# EAGLE design SCH (EAGLE 9.4.2)
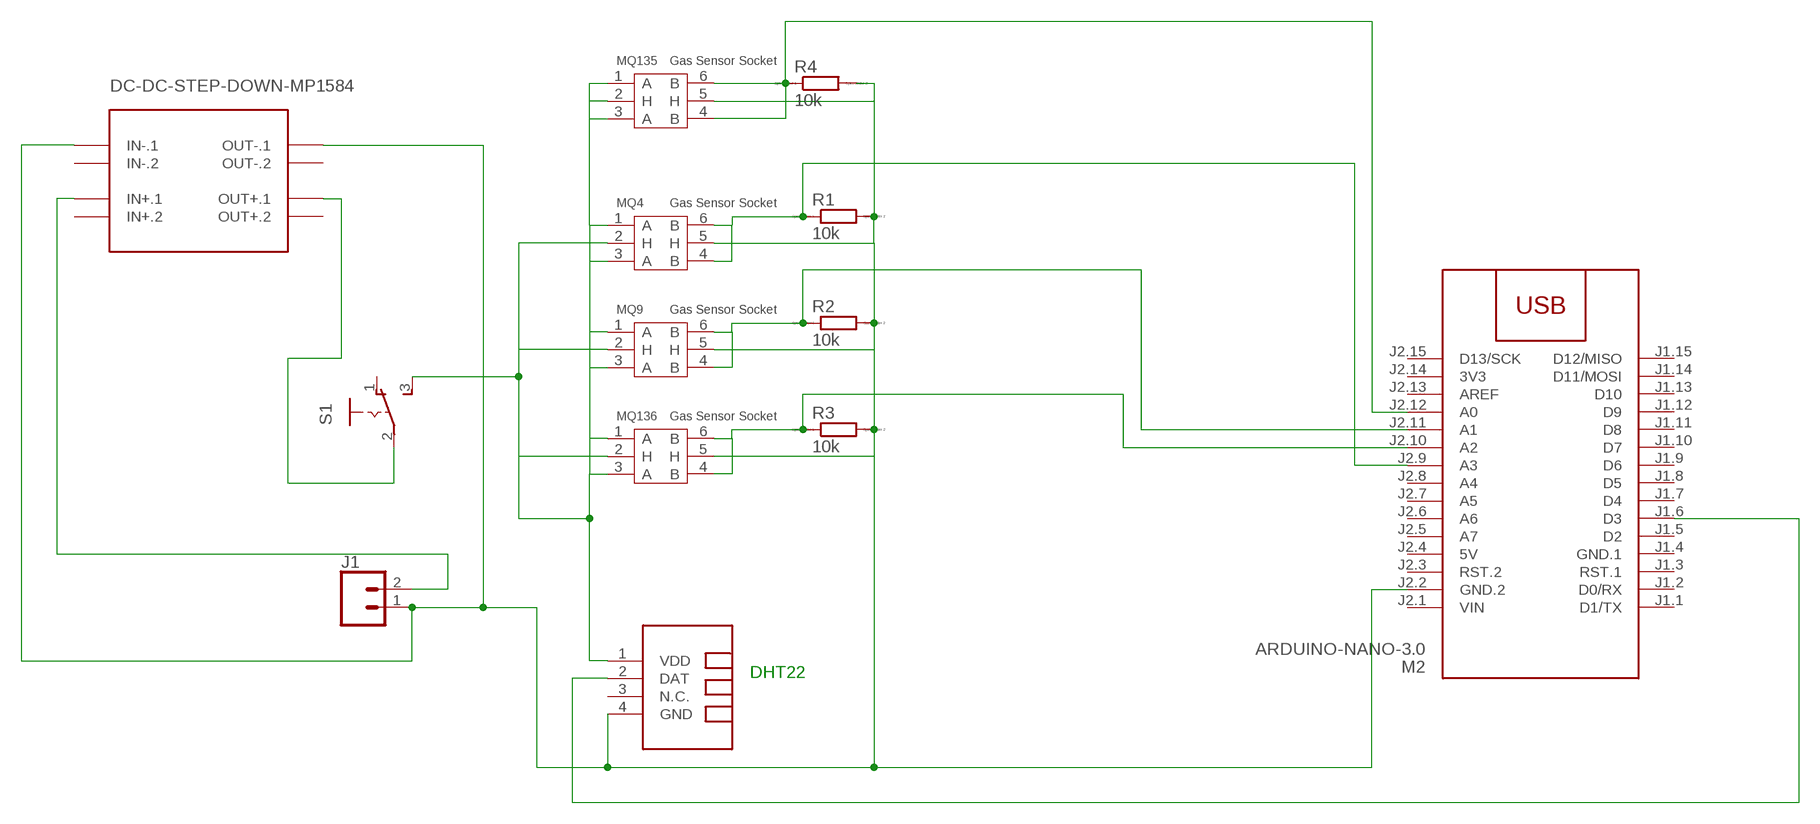
[diagram p0: schematic, sheet 1]

## Parts
J1  CONN_021X02_NO_SILK  [1X02_NO_SILK]
M2  ARDUINO-NANO-3.0  [ARDUINO-NANO-3.0]
MQ4  Gas Sensor Socket  MQ-SOCKET  [6P-D17.6X9.8H]
MQ9  Gas Sensor Socket  MQ-SOCKET  [6P-D17.6X9.8H]
MQ135  Gas Sensor Socket  MQ-SOCKET  [6P-D17.6X9.8H]
MQ136  Gas Sensor Socket  MQ-SOCKET  [6P-D17.6X9.8H]
R1  10k  R0204/7  [0204/7]
R2  10k  R0204/7  [0204/7]
R3  10k  R0204/7  [0204/7]
R4  10k  R0204/7  [0204/7]
S1  255SB  [255SB]
U$1  TEMP-HUM-SENSOR-DHT22  [TEMP-HUM-SENSOR-DHT22]
U$2  DC-DC-STEP-DOWN-MP1584  [DC-DC-STEP-DOWN-MP1584]

## Nets
N$1: M2.J2.9(A3) MQ4.4(B) MQ4.6(B) R1.1
N$2: M2.J2.11(A1) MQ9.4(B) MQ9.6(B) R2.1
N$3: M2.J2.10(A2) MQ136.4(B) MQ136.6(B) R3.1
N$4: J1.1 M2.J2.2(GND.2) MQ4.5(H) MQ9.5(H) MQ135.5(H) MQ136.5(H) R1.2 R2.2 R3.2 R4.2 U$1.4(GND) U$2.IN-.1 U$2.OUT-.1
N$5: MQ4.1(A) MQ4.2(H) MQ4.3(A) MQ9.1(A) MQ9.2(H) MQ9.3(A) MQ135.1(A) MQ135.2(H) MQ135.3(A) MQ136.1(A) MQ136.2(H) MQ136.3(A) S1.3(S) U$1.1(VDD)
N$6: J1.2 U$2.IN+.1
N$7: M2.J2.12(A0) MQ135.4(B) MQ135.6(B) R4.1
N$8: S1.2(P) U$2.OUT+.1
N$10: M2.J1.6(D3) U$1.2(DAT)
Unconnected: M2.J1.1(D1/TX) M2.J1.2(D0/RX) M2.J1.3(RST.1) M2.J1.5(D2) M2.J1.7(D4) M2.J1.8(D5) M2.J1.9(D6) M2.J1.10(D7) M2.J1.11(D8) M2.J1.12(D9) M2.J1.13(D10) M2.J1.14(D11/MOSI) M2.J1.15(D12/MISO) M2.J2.3(RST.2) M2.J2.5(A7) M2.J2.6(A6) M2.J2.7(A5) M2.J2.8(A4) M2.J2.13(AREF) M2.J2.15(D13/SCK) S1.1(O) U$1.3(N.C.) U$2.IN+.2 U$2.IN-.2 U$2.OUT+.2 U$2.OUT-.2

## Notes on the sheet
- DHT22

## Power pins joined to a net without a drawn wire
3V3: M2.J2.14(3V3)
5V: M2.J2.4(5V)
GND.1: M2.J1.4(GND.1)
VIN: M2.J2.1(VIN)

## Library data of the parts
J1 = SparkFun-Connectors:CONN_02: Multi connection point. Often used as Generic Header-pin footprint for 0.1 inch spaced/style header connections On any of the 0.1 inch spaced packages, you can populate with these: Break Away Headers - Straight <https://www.sparkfun.com/products/116> (PRT-00116) Break Away Male Headers - Right Angle <https://www.sparkfun.com/products/553> (PRT-00553) Female Headers <https://www.sparkfun.com/products/115> (PRT-00115) Break Away Headers - Machine Pin <https://www.sparkfun.com/products/117> (PRT-00117) Break Away Female Headers - Swiss Machine Pin <https://www.sparkfun.com/products/743> (PRT-00743) For SCREWTERMINALS and SPRING TERMINALS visit here: Screw Terimnals on SparkFun.com <https://www.sparkfun.com/search/results?term=Screw+Terminals> (5mm/3.5mm/2.54mm spacing) This device is also useful as a general connection point to wire up your design to another part of your project. Our various solder wires solder well into these plated through hole pads. Hook-Up Wire - Assortment (Stranded, 22 AWG) <https://www.sparkfun.com/products/11375> (PRT-11375) Hook-Up Wire - Assortment (Solid Core, 22 AWG) <https://www.sparkfun.com/products/11367> (PRT-11367) View the entire wire category on our website here <https://www.sparkfun.com/categories/141> Special notes: Molex polarized connector foot print use with: PRT-08233 with associated crimp pins and housings. 2.54_SCREWTERM for use with PRT-10571. 3.5mm Screw Terminal footprints for PRT-08084 5mm Screw Terminal footprints for use with PRT-08432
M2 = diy-modules:ARDUINO-NANO-3.0: Arduino Nano 3.0 and compatible devices More details available here: https://www.arduino.cc/en/Main/ArduinoBoardNano Click here to find device on ebay.com <http://www.ebay.com/sch/arduino+nano>
MQ4 MQ9 MQ135 MQ136 = template:MQ-SOCKET
R1-R4 = eagle-ltspice:R: RESISTOR, European symbol; SPICEMODEL: NONE; SPICEPREFIX: R
S1 = switch:255SB: SLIDING SWITCH Distributor Buerklin, 11G810
U$1 = diy-modules:TEMP-HUM-SENSOR-DHT22: DHT22 - digital humidity & temperature sensor Also known as: AM2302 AM2302 datasheet available here: http://akizukidenshi.com/download/ds/aosong/AM2302.pdf Click here to find device on ebay.com <http://www.ebay.com/sch/dht22+digital+sensor>
U$2 = diy-modules:DC-DC-STEP-DOWN-MP1584: DC/DC Step-Down Regulator based on MP1584 chip MP1584 datasheet available here: http://www.haoyuelectronics.com/Attachment/MP1584/MP1584.pdf Click here to find device on ebay.com <http://www.ebay.com/sch/mp1584+module>

## Board
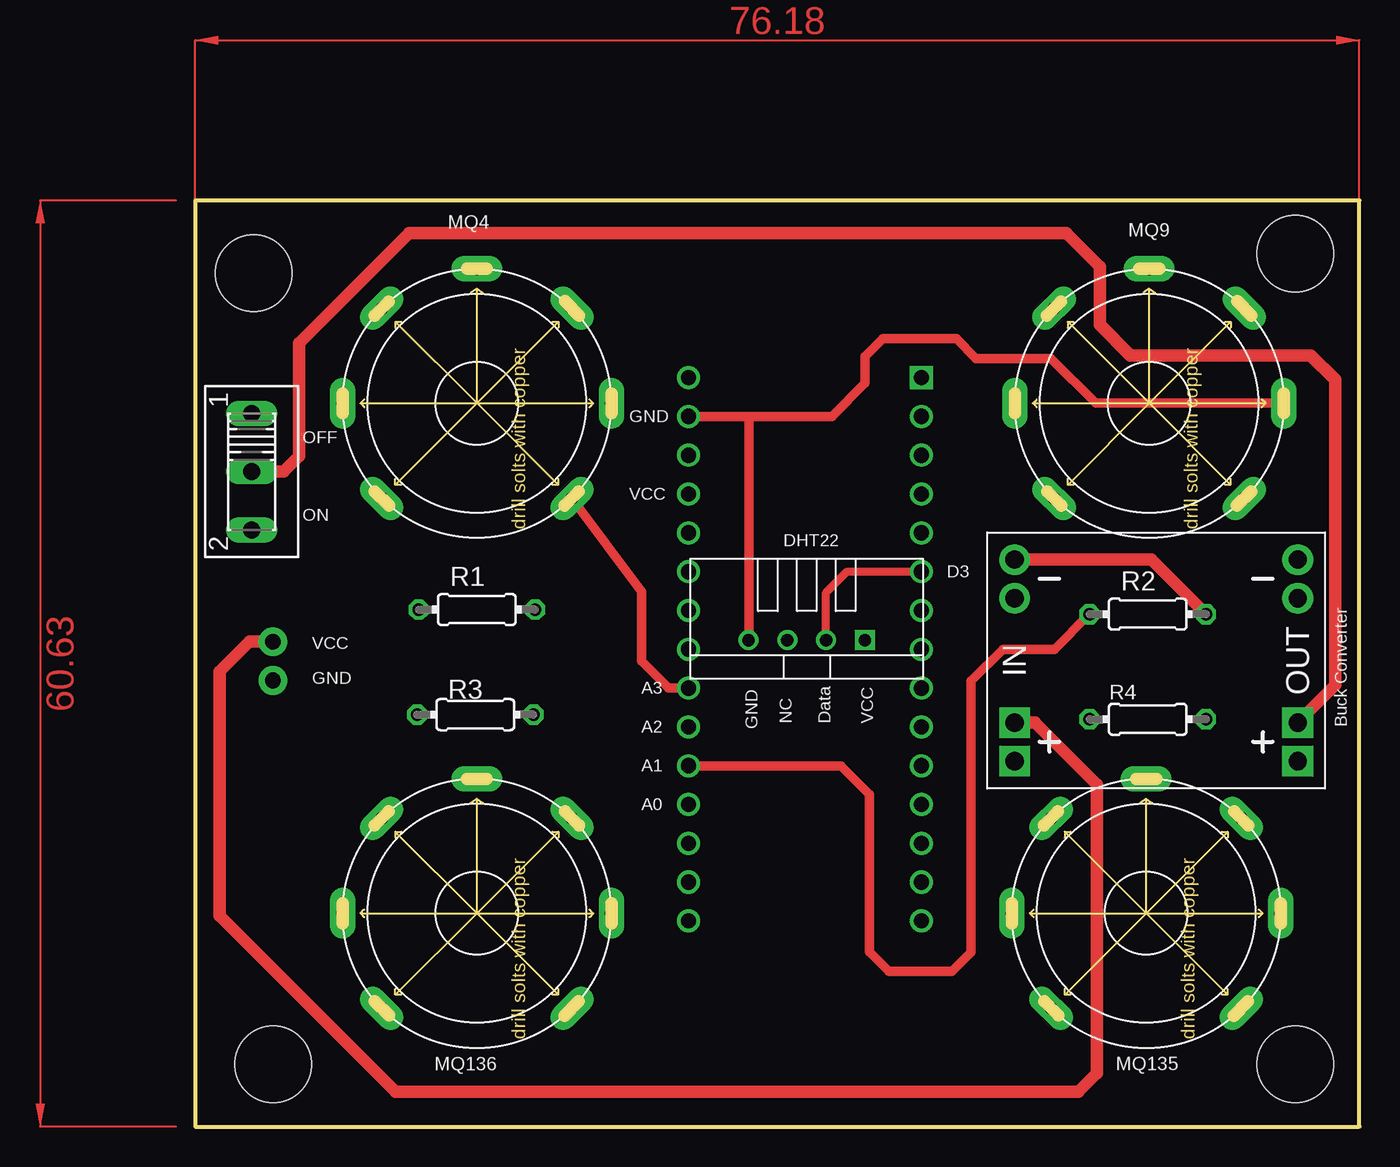
[diagram p1: board, top side]
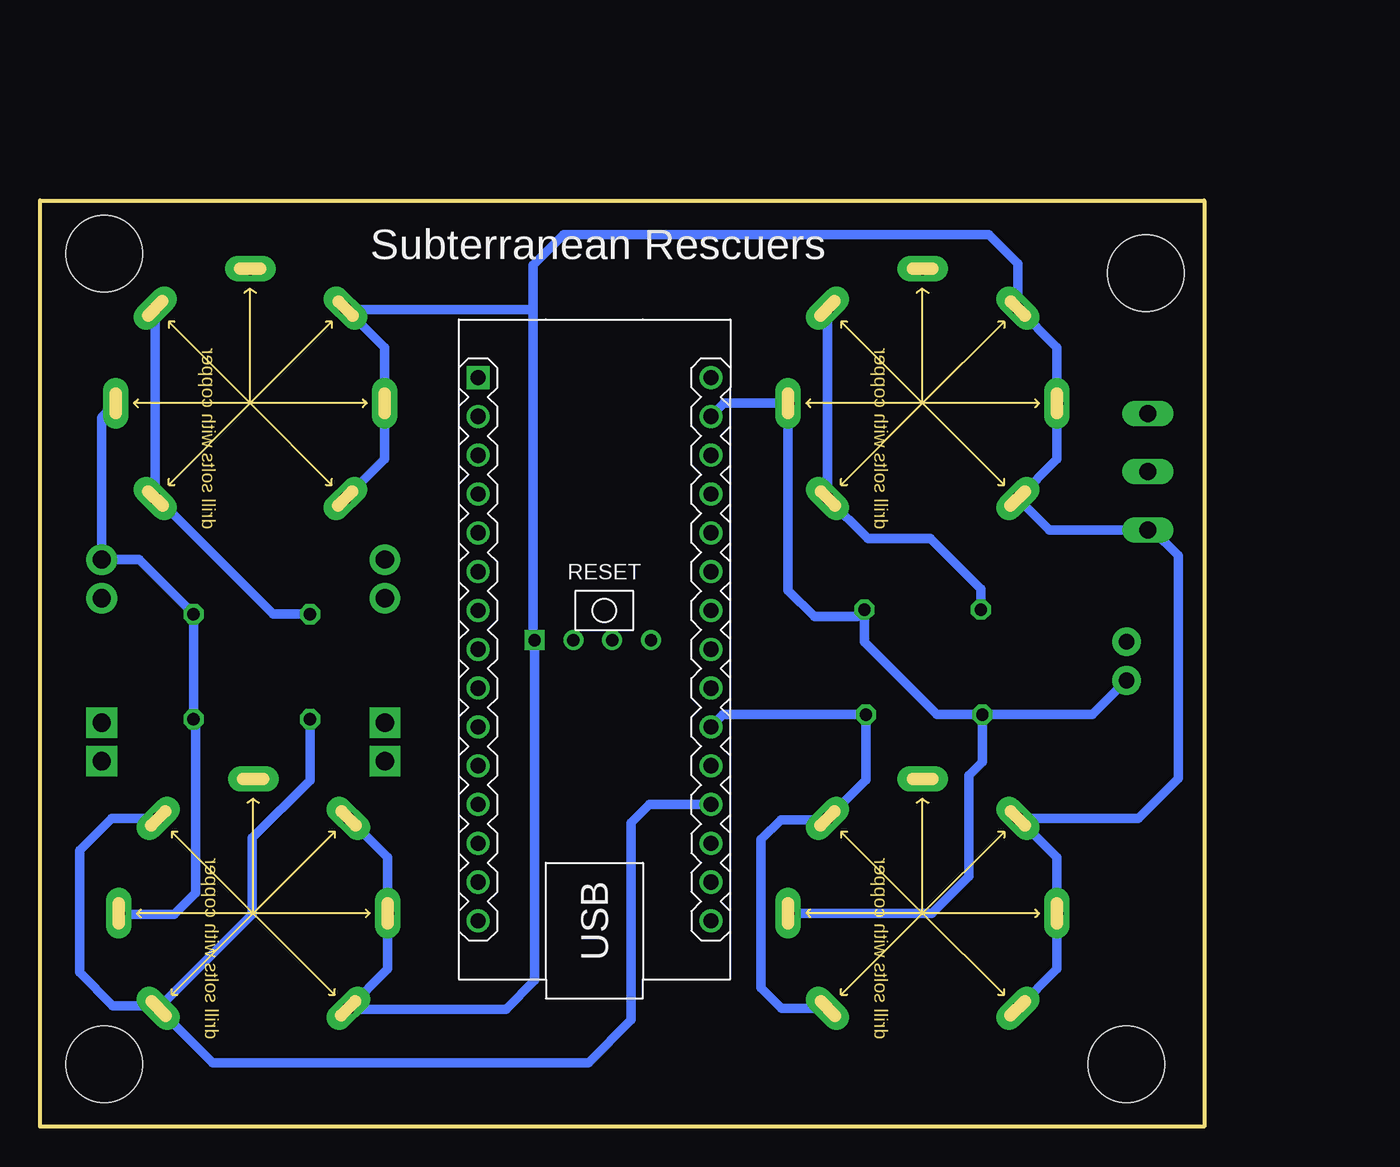
[diagram p2: board, bottom side, seen from below]

Size 76.18 x 60.63 mm. Coordinates in mm from the lower left corner, seen from the top.
Outline: 0,0 76.18,0 76.18,60.63 0,60.63 0,0
Copper layers (1*16): Top 0.035mm / dielectric 1.5mm / Bottom 0.035mm
Design rules "default": minimum track width 6mil, minimum drill 0.35mm, track to track 6mil, track to pad 6mil, pad to pad 6mil, via to via 6mil, smd to smd 6mil, copper to edge 40mil, drill to drill 6mil, minimum pad ring 10mil, minimum via ring 8mil, stop-mask expansion 4mil, vias tented up to drill 0mil, thermal gap 10mil
Holes 5 mm at 3.81,55.88 72,57.15 72,4.09 5.08,4.09

### Footprints (pad centres in the part's own frame; a part is rotated, then mirrored left to right if it is on the bottom)
1X02_NO_SILK = drill 1.016 pad 1.88: 1 0,0; 2 2.54,0
ARDUINO-NANO-3.0 = drill 1 square: J1.1 17.78,7.62 | drill 1: J1.2 15.24,7.62; J1.3 12.7,7.62; J1.4 10.16,7.62; J1.5 7.62,7.62; J1.6 5.08,7.62; J1.7 2.54,7.62; J1.8 0,7.62; J1.9 -2.54,7.62; J1.10 -5.08,7.62; J1.11 -7.62,7.62; J1.12 -10.16,7.62; J1.13 -12.7,7.62; J1.14 -15.24,7.62; J1.15 -17.78,7.62; J2.1 17.78,-7.62; J2.2 15.24,-7.62; J2.3 12.7,-7.62; J2.4 10.16,-7.62; J2.5 7.62,-7.62; J2.6 5.08,-7.62; J2.7 2.54,-7.62; J2.8 0,-7.62; J2.9 -2.54,-7.62; J2.10 -5.08,-7.62; J2.11 -7.62,-7.62; J2.12 -10.16,-7.62; J2.13 -12.7,-7.62; J2.14 -15.24,-7.62; J2.15 -17.78,-7.62
6P-D17.6X9.8H = drill 0.8 pad 1.676 long: 1 -6.223,6.223; 2 0,8.8; 3 6.223,6.223; 4 6.223,-6.223; 5 0,-8.8; 6 -6.223,-6.223; 7 8.8,0
0204/7 = drill 0.813 octagon: 1 -3.81,0; 2 3.81,0
255SB = drill 1.118 long: 1 -3.81,0; 2 0,0; 3 3.81,0
TEMP-HUM-SENSOR-DHT22 = drill 0.8 square: 1 -3.81,0 | drill 0.8: 2 -1.27,0; 3 1.27,0; 4 3.81,0
DC-DC-STEP-DOWN-MP1584 = drill 1.2 pad 2 square: IN+.1 -9.271,-4.064; IN+.2 -9.271,-6.604; OUT+.1 9.271,-4.064; OUT+.2 9.271,-6.604 | drill 1.2 pad 2: IN-.1 -9.271,6.604; IN-.2 -9.271,4.064; OUT-.1 9.271,6.604; OUT-.2 9.271,4.064

### Placement (x,y rotation side)
J1  5.08,29.21 90 top
M2  39.9,31.25 90 bottom
MQ4  18.42,47.35 90 top
MQ9  62.43,47.35 90 top
MQ135  62.23,13.97 90 top
MQ136  18.42,13.97 90 top
R1  18.42,33.85 0 top
R2  62.33,33.55 0 top
R3  18.32,26.97 180 top
R4  62.33,26.67 0 top
S1  3.68,42.88 270 top
U$1  40.01,31.85 180 top
U$2  62.88,30.52 0 top

### Tracks (layer width: path | path; a pad name or v marks a point on that pad's centre or on a via)
N$1
  Top 0.61: MQ4.6 29.21,35.02 29.21,30.48 30.98,28.71 M2.J2.9
  Bottom 0.61: MQ4.4 MQ4.6 22,38.49 17.9,38.49 14.61,35.2 R1.1
N$2
  Top 0.61: M2.J2.11 42.25,23.63 44.12,21.76 44.12,11.43 45.39,10.16 49.53,10.16 50.77,11.4 50.77,29.18 52.84,31.25 56.22,31.25 R2.1
  Bottom 0.61: MQ9.4 MQ9.6 68.5,41.13 60.92,33.55 R2.1
N$3
  Bottom 0.61: MQ136.6 27.66,7.75 29,9.09 29,18.79 27.7,20.09 24.74,20.09 MQ136.4 22.13,22.7 R3.1 31.48,26.97 M2.J2.10
N$4
  Top 0.508: 36.23,46.49 M2.J2.2
  Top 0.61: U$1.4 36.23,31.88 36.23,46.49 | M2.J2.2 41.65,46.49 43.82,48.66 43.82,50.41 45,51.59 49.8,51.59 51.1,50.29 56,50.29 58.94,47.35 MQ9.5
  Top 0.813: U$2.IN-.1 62.57,37.12 R2.2
  Bottom 0.61: M2.J2.2 31.42,47.35 MQ4.5 27.22,35.11 25.5,33.39 22.69,33.39 R1.2 22.23,31.72 17.48,26.97 R3.2 | M2.J2.2 | MQ9.5 71.55,47.03 71.55,47.02 72.15,46.42 U$2.OUT-.1 69.71,37.12 R2.2 R4.2 66,26.55 66,15.29 67.4,13.89 70.95,13.89 MQ135.5 | R3.2 14.51,23.87 15.4,22.98 15.4,16.39 17.82,13.97 MQ136.5 | R3.2 7.32,26.97 J1.1
N$5
  Bottom 0.61: MQ9.1 53.63,43.7 MQ9.2 53.63,51 MQ9.3 56.1,53.47 43.92,53.47 | 43.92,53.47 43.92,31.95 U$1.1 43.82,9.57 45.7,7.69 55.95,7.69 MQ135.1 53.43,10.33 MQ135.2 53.43,17.62 MQ135.3 | 43.92,53.47 43.92,56.41 41.94,58.39 14.1,58.39 12.2,56.49 MQ4.3 9.62,51 MQ4.2 9.62,43.7 MQ4.1 10.14,39.07 S1.3 3.38,39.07 1.7,37.39 1.7,22.79 4.3,20.19 MQ136.3 9.62,17.62 MQ136.2 9.62,10.33 MQ136.1
N$6
  Top 0.813: J1.2 3.56,31.75 1.6,29.79 1.6,13.79 13.1,2.29 57.8,2.29 59,3.49 59,22.39 54.93,26.46 U$2.IN+.1
N$7
  Bottom 0.61: MQ135.6 62.3,13.9 62.3,18.89 58.52,22.67 R4.1 | MQ135.6 64.89,4.19 40.3,4.19 37.5,6.99 37.5,19.89 36.3,21.09 M2.J2.12 | MQ135.4 71.5,20.19 73.6,18.09 73.6,10.09 71.42,7.91 68.62,7.91 MQ135.6
N$8
  Top 0.813: U$2.OUT+.1 74.6,28.91 74.6,48.89 73,50.49 61.2,50.49 59.2,52.49 59.2,56.29 57.01,58.48 14,58.48 6.8,51.28 6.8,43.89 5.79,42.88 S1.2
N$10
  Top 0.508: U$1.2 41.28,34.96 42.65,36.33 M2.J1.6
(copper drawn outside any net)
  shapes: Top area x2

### Text on the board
tPlace: OFF | ON | DHT22 | VCC | GND | GND | NC | Data | VCC | Buck Converter
tNames: GND | VCC | D3 | A3 | A2 | A1 | A0
bNames: Subterranean Rescuers